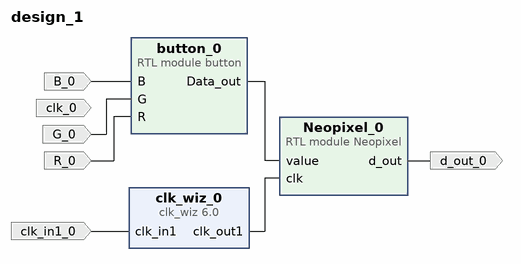
[diagram p0: block diagram of the top level]
# Vivado block design design_1, xc7z020clg400-1, Vivado 2022.1
create_bd_design design_1

create_bd_port -dir O d_out_0
create_bd_port -dir I R_0
create_bd_port -dir I G_0
create_bd_port -dir I B_0
create_bd_port -dir I -type clk clk_0
create_bd_port -dir I -type clk clk_in1_0

create_bd_cell -type module -reference Neopixel Neopixel_0
create_bd_cell -type ip -vlnv xilinx.com:ip:clk_wiz:6.0 clk_wiz_0
set_property -dict [list \
  CONFIG.CLKOUT1_JITTER 151.636 \
  CONFIG.CLKOUT1_REQUESTED_OUT_FREQ 50.000 \
  CONFIG.MMCM_CLKOUT0_DIVIDE_F 20.000 \
] [get_bd_cells clk_wiz_0]
create_bd_cell -type module -reference button button_0

# ---- connections ----

connect_bd_net -net B_0_1 [get_bd_ports B_0] [get_bd_pins button_0/B]
connect_bd_net -net G_0_1 [get_bd_ports G_0] [get_bd_pins button_0/G]
connect_bd_net [get_bd_pins Neopixel_0/d_out] [get_bd_ports d_out_0]
connect_bd_net -net R_0_1 [get_bd_ports R_0] [get_bd_pins button_0/R]
connect_bd_net [get_bd_pins button_0/Data_out] [get_bd_pins Neopixel_0/value]
connect_bd_net -net clk_in1_0_1 [get_bd_ports clk_in1_0] [get_bd_pins clk_wiz_0/clk_in1]
connect_bd_net [get_bd_pins clk_wiz_0/clk_out1] [get_bd_pins Neopixel_0/clk]

validate_bd_design
save_bd_design
